# Altium project Drone.PrjPcb
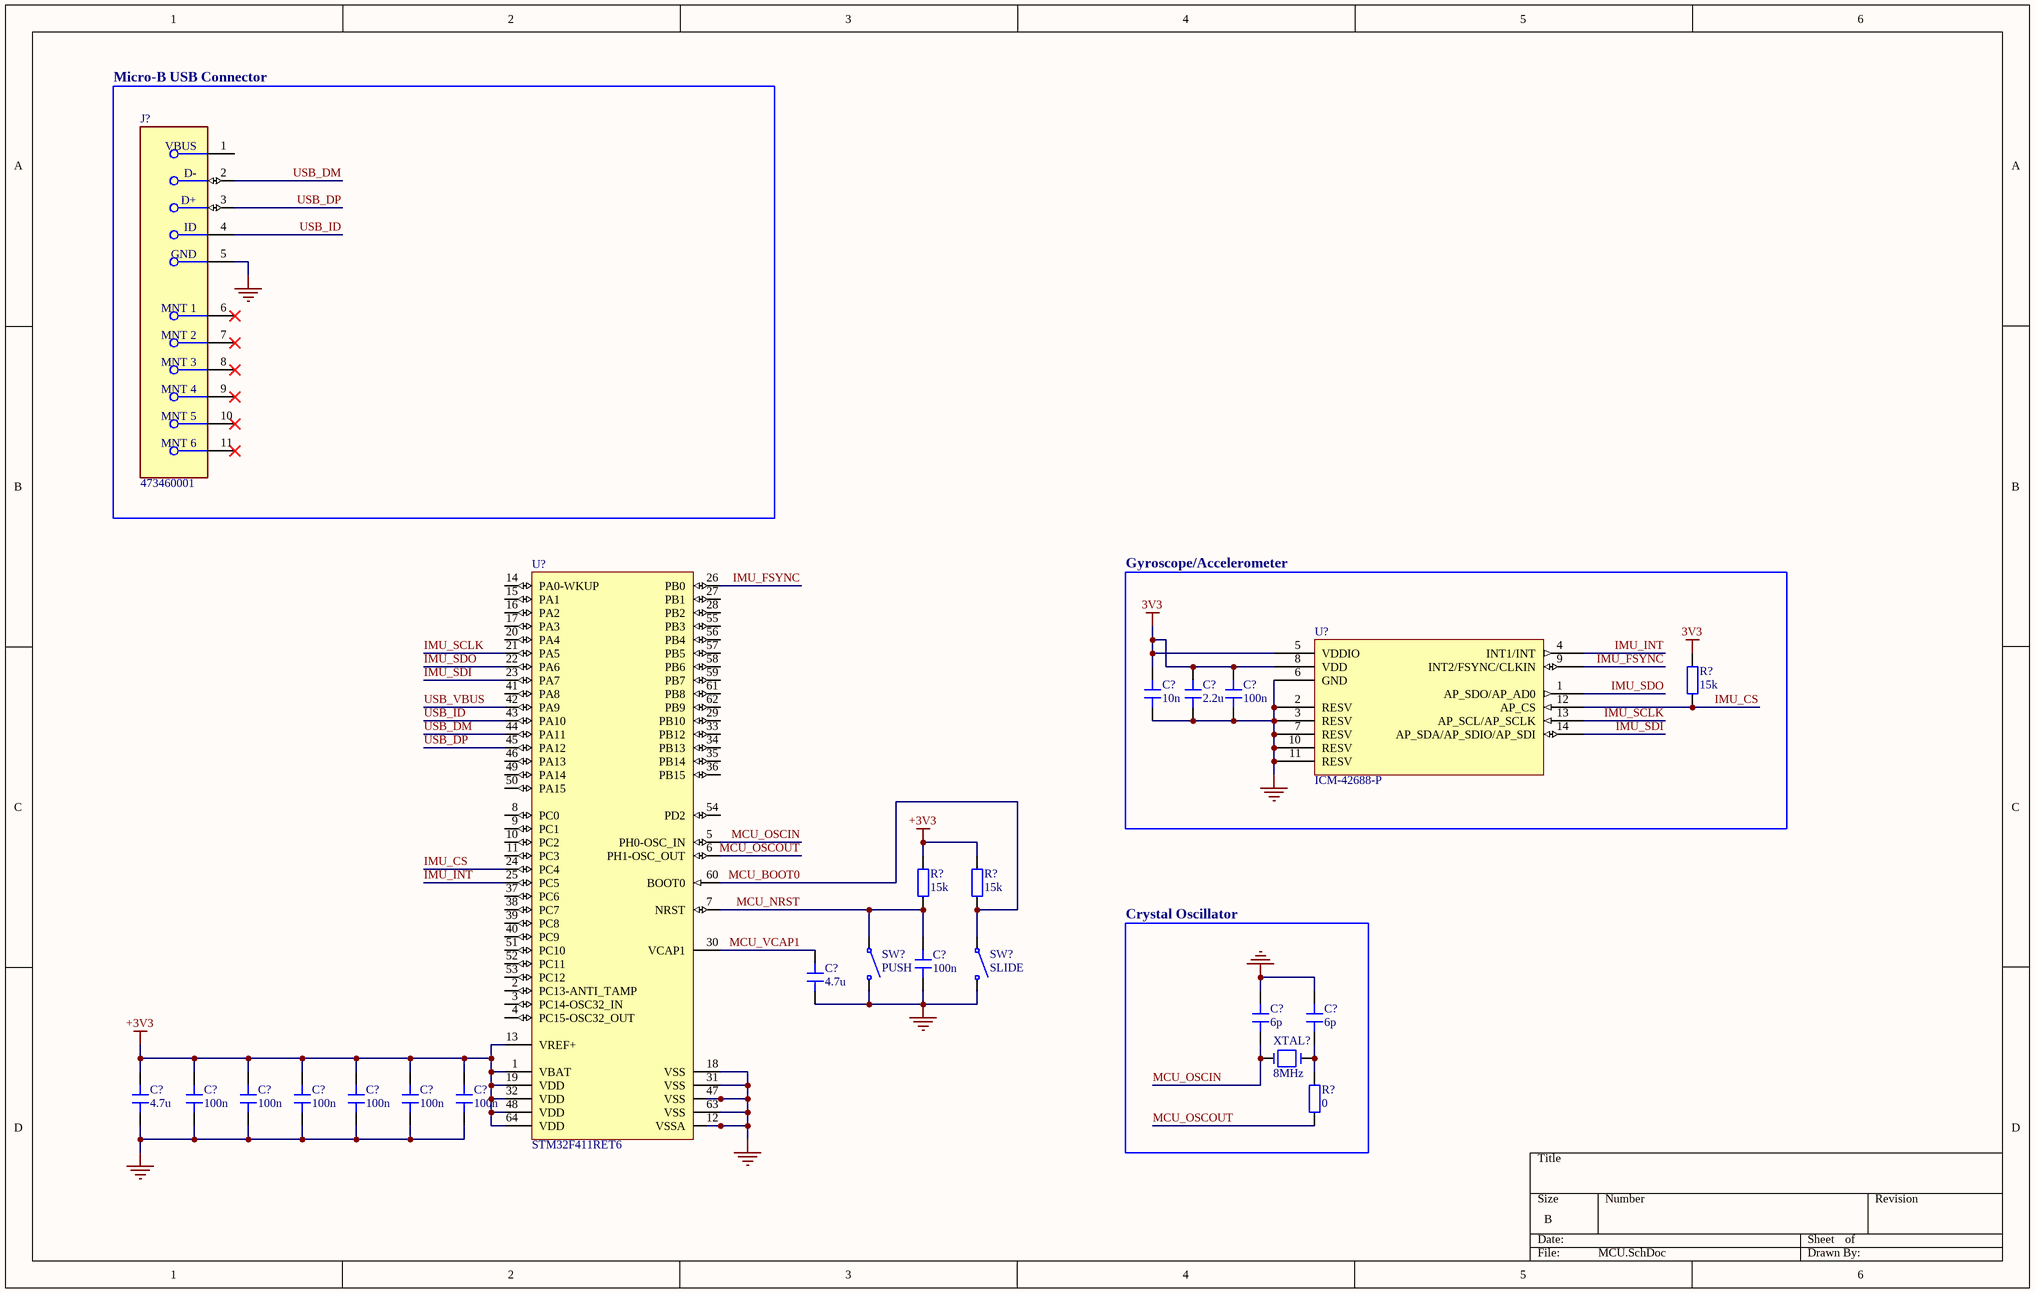
[diagram p0: MCU.SchDoc]
1 sheet, 24 parts. Net scope: global (net labels, ports and power ports of the same name join across sheets).

## Sheet MCU.SchDoc
size B; SheetNumber: 1; SheetTotal: 1

### Parts
(Parts that share a designator on the sheet are numbered #1, #2 ... from top to bottom, then left to right.)
C?#1  10n
C?#2  2.2u
C?#3  100n
C?#4  100n  [CAP_0402_100nF_16V_CL05B104KO5NNNC]
C?#5  4.7u
C?#6  6p
C?#7  6p
C?#8  4.7u
C?#9  100n  [CAP_0402_100nF_16V_CL05B104KO5NNNC]
C?#10  100n  [CAP_0402_100nF_16V_CL05B104KO5NNNC]
C?#11  100n  [CAP_0402_100nF_16V_CL05B104KO5NNNC]
C?#12  100n  [CAP_0402_100nF_16V_CL05B104KO5NNNC]
C?#13  100n  [CAP_0402_100nF_16V_CL05B104KO5NNNC]
C?#14  100n  [CAP_0402_100nF_16V_CL05B104KO5NNNC]
J?  473460001  [FP-473460001-MFG]
R?#1  15k  [RES_0402_15k_50V_0402WGF1502TCE]
R?#2  15k  [RES_0402_15k_50V_0402WGF1502TCE]
R?#3  15k  [RES_0402_15k_50V_0402WGF1502TCE]
R?#4  0  [RES_0402_0R_50V_0402WGF0000TCE]
SW?#1  PUSH
SW?#2  SLIDE
U?#1  STM32F411RET6  [STM32F411RET6]
U?#2  ICM-42688-P
XTAL?  8MHz

### Blocks framed on the sheet
Micro-B USB Connector: J?
Gyroscope/Accelerometer: C?#1-C?#3 R?#1 U?#2
Crystal Oscillator: C?#6 C?#7 R?#4 XTAL?

### Nets
3V3: C?#1.2 C?#2.2 C?#3.2 R?#1.1 U?#2.5(VDDIO) U?#2.8(VDD)
+3V3: C?#8.2 C?#9.2 C?#10.2 C?#11.2 C?#12.2 C?#13.2 C?#14.2 R?#2.1 R?#3.1 U?#1.1(VBAT) U?#1.13(VREF+) U?#1.19(VDD) U?#1.32(VDD) U?#1.48(VDD) U?#1.64(VDD)
GND: C?#1.1 C?#2.1 C?#3.1 C?#4.1 C?#5.1 C?#6.2 C?#7.2 C?#8.1 C?#9.1 C?#10.1 C?#11.1 C?#12.1 C?#13.1 C?#14.1 J?.5(GND) SW?#1.2 SW?#2.2 U?#1.12(VSSA) U?#1.18(VSS) U?#1.31(VSS) U?#1.47(VSS) U?#1.63(VSS) U?#2.2(RESV) U?#2.3(RESV) U?#2.6(GND) U?#2.7(RESV) U?#2.10(RESV) U?#2.11(RESV)
IMU_CS: R?#1.2 U?#1.24(PC4) U?#2.12(AP_CS)
IMU_FSYNC: U?#1.26(PB0) U?#2.9(INT2/FSYNC/CLKIN)
IMU_INT: U?#1.25(PC5) U?#2.4(INT1/INT)
IMU_SCLK: U?#1.21(PA5) U?#2.13(AP_SCL/AP_SCLK)
IMU_SDI: U?#1.23(PA7) U?#2.14(AP_SDA/AP_SDIO/AP_SDI)
IMU_SDO: U?#1.22(PA6) U?#2.1(AP_SDO/AP_AD0)
MCU_BOOT0: R?#3.2 SW?#2.1 U?#1.60(BOOT0)
MCU_NRST: C?#4.2 R?#2.2 SW?#1.1 U?#1.7(NRST)
MCU_OSCIN: C?#6.1 U?#1.5(PH0-OSC_IN) XTAL?.1
MCU_OSCOUT: R?#4.1 U?#1.6(PH1-OSC_OUT)
MCU_VCAP1: C?#5.2 U?#1.30(VCAP1)
USB_DM: J?.2(D-) U?#1.44(PA11)
USB_DP: J?.3(D+) U?#1.45(PA12)
USB_ID: J?.4(ID) U?#1.43(PA10)
USB_VBUS: U?#1.42(PA9)
NetC?#7_1: C?#7.1 R?#4.2 XTAL?.2

Not connected (* = marked no-connect by the designer): J? 1(VBUS) 6(MNT_1)* 7(MNT_2)* 8(MNT_3)* 9(MNT_4)* 10(MNT_5)* 11(MNT_6)*; U?#1 2(PC13-ANTI_TAMP) 3(PC14-OSC32_IN) 4(PC15-OSC32_OUT) 8(PC0) 9(PC1) 10(PC2) 11(PC3) 14(PA0-WKUP) 15(PA1) 16(PA2) 17(PA3) 20(PA4) 27(PB1) 28(PB2) 29(PB10) 33(PB12) 34(PB13) 35(PB14) 36(PB15) 37(PC6) 38(PC7) 39(PC8) 40(PC9) 41(PA8) 46(PA13) 49(PA14) 50(PA15) 51(PC10) 52(PC11) 53(PC12) 54(PD2) 55(PB3) 56(PB4) 57(PB5) 58(PB6) 59(PB7) 61(PB8) 62(PB9)

### Library data of the parts
C?#1 = CAP_0402_10nF_16V
C?#2 = CAP_0402_2.2uF_16V
C?#3 C?#4 C?#9-C?#14 = CAP_0402_100nF_16V
C?#5 C?#8 = CAP_0402_4.7uF_16V
C?#6 C?#7 = CAP_0402_6pF_50V
J? = CMP-2000-05246-2: CONN RCPT USB2.0 MICRO B SMD R/A; Manufacturer: Molex; Conn Orientation: Right Angle; Is Female: yes; Shielding: true; Pitch: 0.65mm; Number Of Contacts: 5; Description: USB - micro B USB 2.0 Receptacle Connector 5 Position Surface Mount, Right Angle; Voltage Rating: 30V; Current Rating: 1.8A; Device Class L2: USB Connectors; Digikey Description: CONN RCPT USB2.0 MICRO B SMD R/A; Height: 2.945mm; RoHS: TRUE; ComponentLink2Description: Datasheet; Octopart: https://octopart.com/47346-0001-molex-7164928; Automotive: No; Package: 0; Category: Conn; Device Class L1: Connectors; Usb Standard: USB 2.0; Temperature: -30°C to +85°C; Temperature Range Low: -30°C; Footprint Url: https://www.molex.com/pdm_docs/sd/473460001_sd.pdf; ComponentLink2URL: https://www.molex.com/webdocs/datasheets/pdf/en-us/0473460001_IO_CONNECTORS.pdf; Lead Free: Yes; Manufacturer Part Number: 473460001; Contact Material: Gold,Nickel; Temperature Range High: +85°C; Device Class L3: unset
R?#1-R?#3 = RES_0402_15k_50V
R?#4 = RES_0402_0R_50V
SW?#1 SW?#2 = SW_PUSH_BUTTON
U?#1 = STM32F411RET6: -40℃~+85℃ 1.7V~3.6V 100MHz 128KB 12bit 32 Bit 50 512KB ARM Cortex-M4 Built-in FLASH LQFP-64(10x10) Microcontrollers (MCU/MPU/SOC) ROHS; Packing: Tray; Operating Frequency(F) (Processor speed) (MHz): 100; FLASH Size (Prog) (kB): 512; Supply Voltage(Vcc) min (V): 1.7; Internal RAM Size (kB): 128; I/Os (High Current): 50; ComponentLink1Description: Manufacturer URL; Package Description: LQFP64; DatasheetVersion: Rev. 6; Mounting Technology: Surface Mount; Package Reference: 64-Pin Low-profile Quad Flat Package, Body 10 x 10 mm, Pitch 0.5 mm; ComponentLink2Description: Datasheet; Core: ARM Cortex-M4; ComponentLink2URL: http://www.st.com/st-web-ui/static/active/en/resource/technical/document/datasheet/DM00115249.pdf; ComponentLink1URL: http://www.st.com/
U?#2 = ICM-42688-P: -40℃~+85℃ 1.71V~3.6V 16bit 2KB 7.5uA IMU (accelerometer + gyroscope) SPI、I2C X,Y,Z X,Y,Z ±16g ±2000dps Motion Event Detection, Synchronization, Timestamp Support LGA-14(2.5x3) Accelerometers ROHS
XTAL? = OSC_8MHz_10pF